# Altium schematic sheet CurrentControl.SchDoc
size A4; SheetNumber: 2; SheetTotal: 3
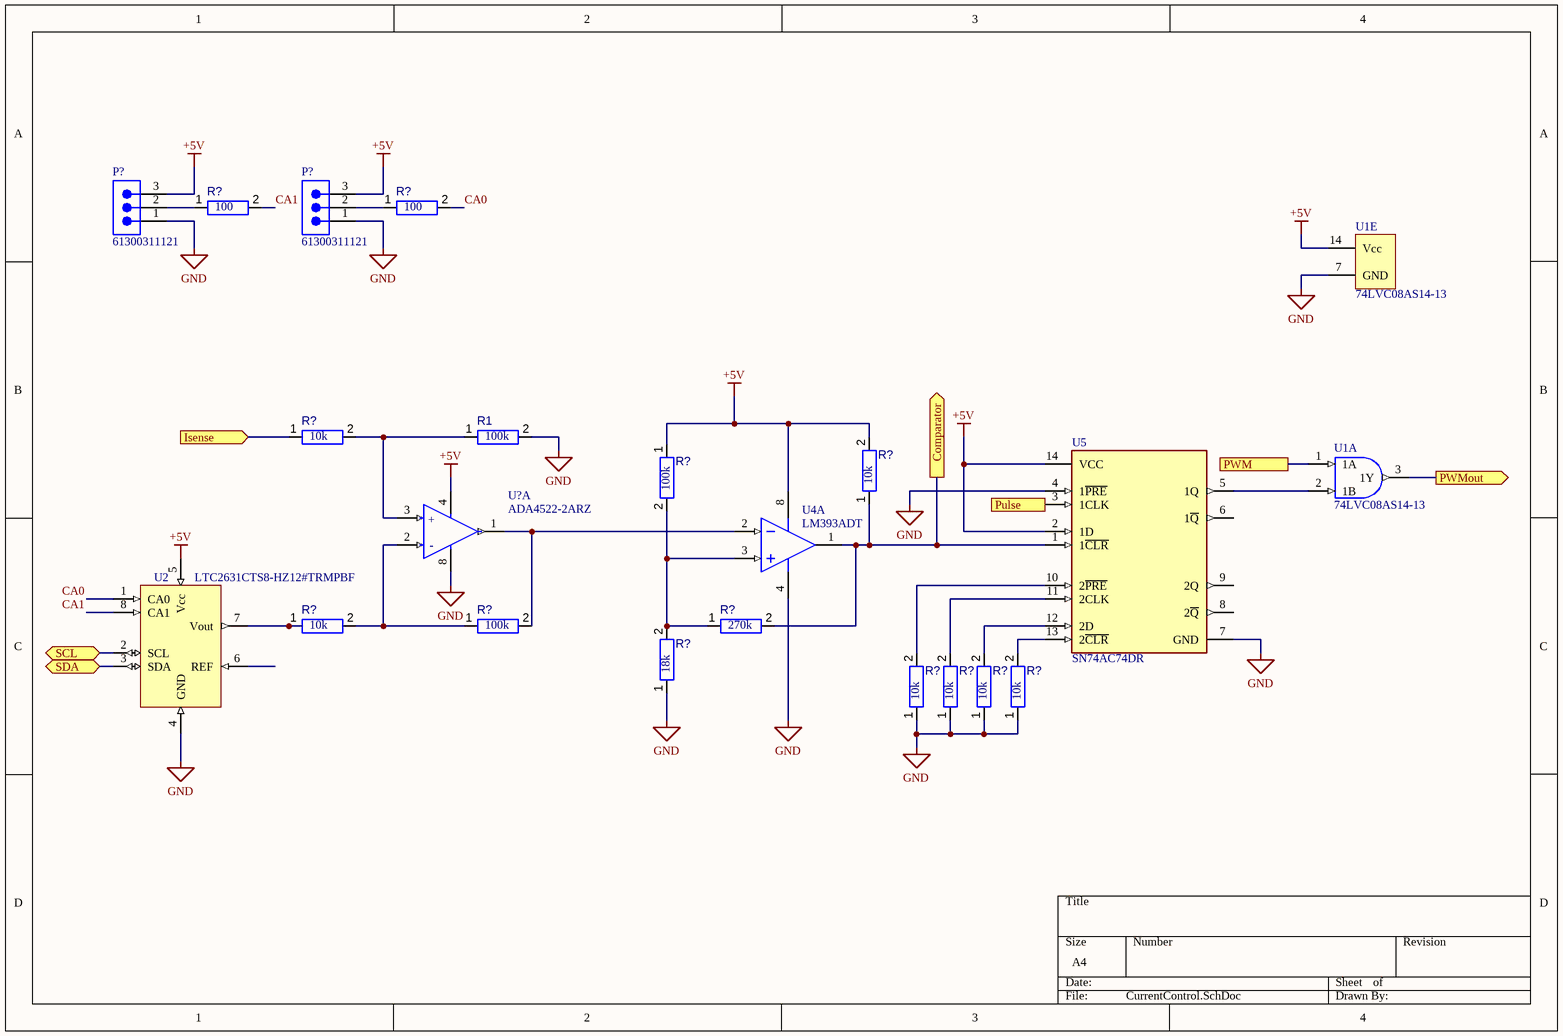
[diagram p0: CurrentControl.SchDoc]

## Parts
(Parts that share a designator on the sheet are numbered #1, #2 ... from top to bottom, then left to right.)
P?#1  61300311121  [61300311121]
P?#2  61300311121  [61300311121]
R1  value 100k  [RESA60-630X240]  (hidden comment: 100k-ThroughHole-250mW)
R?#1  value 100  [RESA60-630X240]  (hidden comment: 100Ohm-ThroughHole-250mW)
R?#2  value 100  [RESA60-630X240]  (hidden comment: 100Ohm-ThroughHole-250mW)
R?#3  value 10k  [RESA60-630X240]  (hidden comment: 10k-ThroughHole-250mW)
R?#4  value 100k  [RESA60-630X240]  (hidden comment: 100k-ThroughHole-250mW)
R?#5  value 10k  [RESA60-630X240]  (hidden comment: 10k-ThroughHole-250mW)
R?#6  value 10k  [RESA60-630X240]  (hidden comment: 10k-ThroughHole-250mW)
R?#7  value 100k  [RESA60-630X240]  (hidden comment: 100k-ThroughHole-250mW)
R?#8  value 270k  [RESA60-630X240]  (hidden comment: 270k-ThroughHole-250mW)
R?#9  value 18k  [RESA60-630X240]  (hidden comment: 18kOhm-ThroughHole-250mW)
R?#10  value 10k  [RESA60-630X240]  (hidden comment: 10k-ThroughHole-250mW)
R?#11  value 10k  [RESA60-630X240]  (hidden comment: 10k-ThroughHole-250mW)
R?#12  value 10k  [RESA60-630X240]  (hidden comment: 10k-ThroughHole-250mW)
R?#13  value 10k  [RESA60-630X240]  (hidden comment: 10k-ThroughHole-250mW)
U1  74LVC08AS14-13  [SOIC127P600X173-14N]  (parts A,E of 5)
U2  LTC2631CTS8-HZ12#TRMPBF  [TSOP65P280X100-8N]
U4  LM393ADT  [ONSC-SOIC-8-751-07_AJ_V]  (part A of 2)
U5  SN74AC74DR  [FP-D0014A-MFG]
U?  ADA4522-2ARZ  [FP-R-8-IPC_C]  (part A of 2)

## Ports
Comparator (out), Isense (in), Pulse (in), PWM, PWMout (out), SCL (bidir), SDA (bidir)

## Nets
+5V: P?#1.3 P?#2.3 R?#4.1 R?#5.2 U1.14(Vcc) U2.5(Vcc) U4.8(VCC) U5.2(1D) U5.14(VCC) U?.4(V-)
GND: P?#1.1 P?#2.1 R1.2 R?#9.1 R?#10.1 R?#11.1 R?#12.1 R?#13.1 U1.7(GND) U2.4(GND) U4.4(GND) U5.4(1~{PRE}) U5.7(GND) U?.8(V+)
CA0: R?#2.2 U2.1(CA0)
CA1: R?#1.2 U2.8(CA1)
Comparator: R?#5.1 R?#8.2 U4.1(OUT1) U5.1(1~{CLR}) ; port Comparator
Isense: R?#3.1 ; port Isense
Pulse: U5.3(1CLK) ; port Pulse
PWM: U1.1(1A) ; port PWM
PWMout: U1.3(1Y) ; port PWMout
SCL: U2.2(SCL) ; port SCL
SDA: U2.3(SDA) ; port SDA
NetP?#1_2: P?#1.2 R?#1.1
NetP?#2_2: P?#2.2 R?#2.1
NetR1_1: R1.1 R?#3.2 U?.3(+IN_A)
NetR?#4_2: R?#4.2 R?#8.1 R?#9.2 U4.3(IN1+)
NetR?#6_1: R?#6.1 U2.7(Vout)
NetR?#6_2: R?#6.2 R?#7.1 U?.2(-IN_A)
NetR?#7_2: R?#7.2 U4.2(IN1-) U?.1(OUT_A)
NetR?#10_2: R?#10.2 U5.10(2~{PRE})
NetR?#11_2: R?#11.2 U5.11(2CLK)
NetR?#12_2: R?#12.2 U5.12(2D)
NetR?#13_2: R?#13.2 U5.13(2~{CLR})
NetU1_2: U1.2(1B) U5.5(1Q)

Not connected (* = marked no-connect by the designer): U2 6(REF); U5 6(1~{Q}) 8(2~{Q}) 9(2Q)

## Notes on the sheet
- (in symbol CMP-014-00005-1, part A) +; -

## Library data of the parts
P?#1 P?#2 = CMP-002-00212-1: WR-PHD Pin Header, THT, Vertical, pitch 2.54mm, 1 Row, 3P; Manufacturer: Wurth Elektronik; Contact Resistance: 20mOhm; Withstanding Voltage: 500V; Rated Current: 3A; Working Voltage: 250V; Pin Count: 3; Gender: Pin Header; Pins: 3; Number of Rows: 1; Packaging: Bag; Pitch: 2.54mm; Match Code: WR-PHD; ComponentLink1URL: https://www.we-online.com/redexpert/article/61300311121?ad; ComponentLink2URL: https://www.we-online.com/redexpert/spec/61300311121?ad; Orientation: Vertical; Operating Temperature Min: -40°C; Mount: Through Hole; Operating Temperature Max: 105°C; Source: WR-PHD.SchLib; Manufacturer Part Number: 61300311121; Design Item ID: 61300311121; Category: Board-to-Board Connectors; ComponentLink1Description: Website Link; Component Type: Standard; ComponentLink2Description: Datasheet Link
R1 R?#4 R?#7 = CMP-009-00192-1: 100kOhm Resistor, Through hole, 250mW; Voltage Rating: 158V; Tolerance: 5%; Case/Package: ThroughHole; Power: 250mW
R?#1 R?#2 = CMP-009-00195-1: 100Ohm Resistor Through Hole 1/4W; Voltage Rating: 5V; Tolerance: 5%; Power: 250mW; Case/Package: THT
R?#3 R?#5 R?#6 R?#10-R?#13 = CMP-009-00196-1: 10kOhm Resistor, Through Hole, 1/4W; Power: 250mW; Tolerance: 5%; Voltage Rating: 50V; Case/Package: THT; Pins: 2
R?#8 = CMP-009-00198-1: 270kOhm Resistor, Through Hole, 1/4W; Tolerance: 5%; Voltage Rating: 244V; Power: 250mW; Pins: 2; Case/Package: THT; Mounting Technology: THT
R?#9 = CMP-009-00197-1: 18kOhm Resistor, Through Hole, 1/4W; Power: 250mW; Tolerance: 5%; Voltage Rating: 67V; Pins: 2; Mounting Technology: THT; Case/Package: THT
U1 = CMP-016-00011-1: 74LVC Series 5.5 V Surface Mount Quadruple 2-Input AND Gate - SOIC-14; Min Supply Voltage: 1.65V; Max Supply Voltage: 5.5V; Case/Package: SO; Min Operating Temperature: -40°C; Pins: 14; Mounting Technology: Surface Mount; Max Operating Temperature: 125°C
U2 = CMP-00024-00009-3: IC DAC 12BIT V-OUT TSOT23-8 12 Bit Digital to Analog Converter 1 TSOT-23-8; Min Supply Voltage: 4.5V; Max Supply Voltage: 5.5V; Number of Channels: 1; Number of Bits: 12; Interface: 2-Wire, I2C; Max Operating Temperature: 70°C; Pins: 8; Min Operating Temperature: 0°C; Mounting Technology: Surface Mount; Case/Package: TSOT
U4 = CMP-014-00006-1: LM393 Series Dual 36 V 100 nA SMT Low Power Voltage Comparator - SOIC-8; Min Supply Voltage: 2V; Number of Channels: 2; Max Supply Voltage: 36V; Max Supply Current: 2.5mA; Output Type: TTL; Min Operating Temperature: 0°C; Case/Package: SO; Pins: 8; Max Operating Temperature: 70°C; Mounting Technology: Surface Mount
U5 = CMP-016-00012-1: Dual Positive-Edge-Triggered D-Type Flip-Flops With Clear and Preset 14-SOIC -40 to 85; Min Supply Voltage: 2V; Nominal Supply Current: 2µA; Frequency: 160MHz; Max Supply Voltage: 6V; Min Operating Temperature: -40°C; Pins: 14; Case/Package: SOIC; Mounting Technology: Surface Mount; Max Operating Temperature: 85°C
U? = CMP-014-00005-1: IC OPAMP ZERO-DRIFT 2 CIRC 8SOIC Zero-Drift Amplifier 2 Circuit Rail-to-Rail 8-SOIC; Min Supply Voltage: 4.5V; Max Supply Voltage: 55V; Case/Package: SOIC; Mounting Technology: Surface Mount; Min Operating Temperature: -40°C; Max Operating Temperature: 125°C; Pins: 8